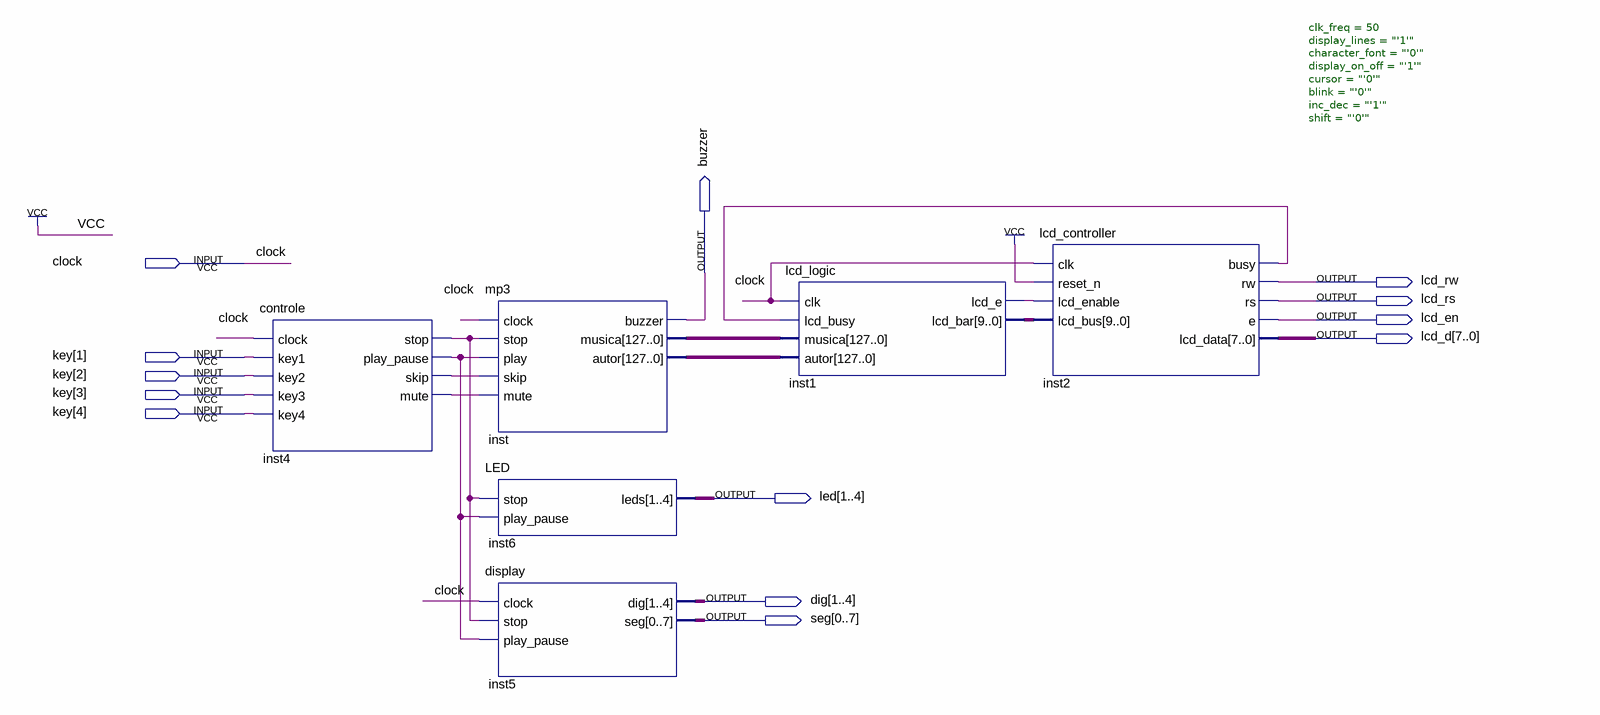
[diagram p0: schematic sheet]
// Quartus schematic buzzer_controlavel.bdf as structural Verilog: 6 symbols, 13 pins
module buzzer_controlavel (
  input  clock,
  input  [4:1] key,
  output buzzer,
  output lcd_rw,
  output lcd_rs,
  output lcd_en,
  output [7:0] lcd_d,
  output [1:4] led,
  output [1:4] dig,
  output [0:7] seg
);

  wire inst1_lcd_e, inst2_busy, inst4_mute, inst4_play_pause, inst4_skip, inst4_stop;
  wire [9:0] inst1_lcd_bar;
  wire [127:0] inst_autor, inst_musica;

  controle inst4 (
    .clock(clock), .key1(key[1]), .key2(key[2]), .key3(key[3]), .key4(key[4]), .stop(inst4_stop),
    .play_pause(inst4_play_pause), .skip(inst4_skip), .mute(inst4_mute));
  mp3 inst (
    .clock(clock), .stop(inst4_stop), .play(inst4_play_pause), .skip(inst4_skip), .mute(inst4_mute),
    .buzzer(buzzer), .musica(inst_musica), .autor(inst_autor));
  LED inst6 (.stop(inst4_stop), .play_pause(inst4_play_pause), .leds(led));
  display inst5 (.clock(clock), .stop(inst4_stop), .play_pause(inst4_play_pause), .dig(dig), .seg(seg));
  lcd_logic inst1 (
    .clk(clock), .lcd_busy(inst2_busy), .musica(inst_musica), .autor(inst_autor), .lcd_e(inst1_lcd_e),
    .lcd_bar(inst1_lcd_bar));
  lcd_controller #(.clk_freq(50), .display_lines("'1'"), .character_font("'0'"), .display_on_off("'1'"), .cursor("'0'"), .blink("'0'"), .inc_dec("'1'"), .shift("'0'")) inst2 (
    .clk(clock), .reset_n(1'b1), .lcd_enable(inst1_lcd_e), .lcd_bus(inst1_lcd_bar), .busy(inst2_busy),
    .rw(lcd_rw), .rs(lcd_rs), .e(lcd_en), .lcd_data(lcd_d));
endmodule
